# EAGLE design diyduino (EAGLE 8.4.1)
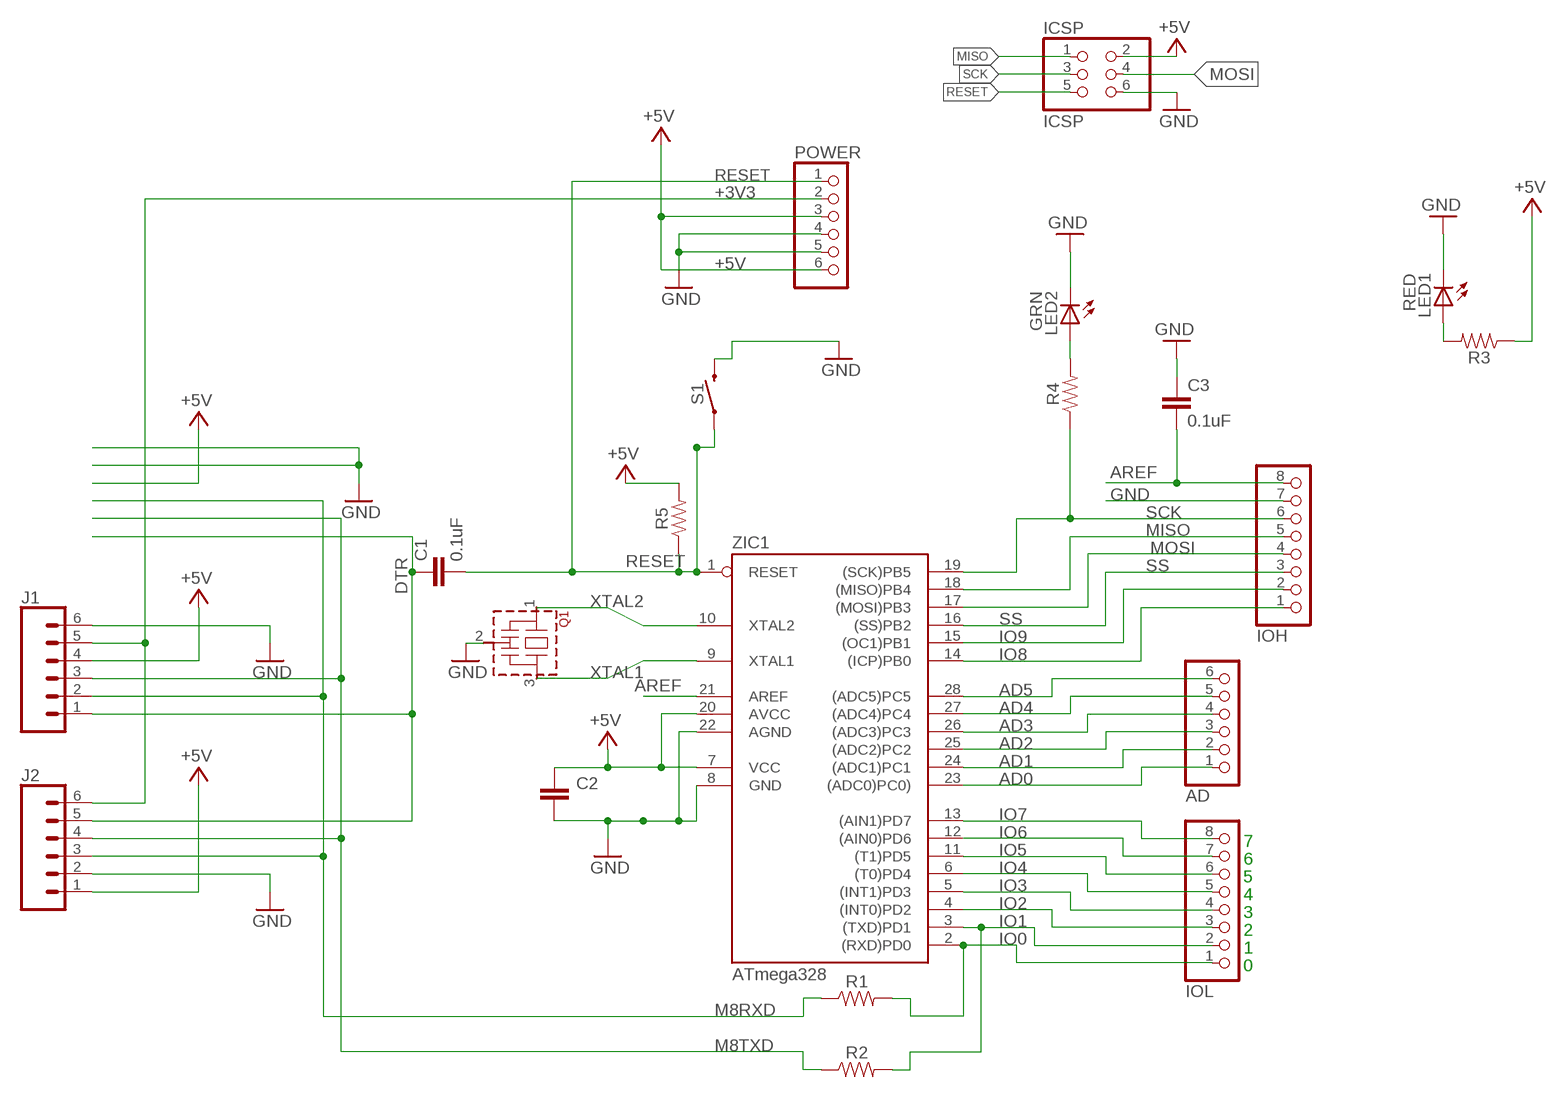
[diagram p0: schematic, sheet 1]

## Parts
AD  PINHD-1X6  [1X06]
C1  0.1uF  C2.5/2  [C2.5-2]
C2  0.1uF  C2.5/2  [C2.5-2]
C3  0.1uF  C2.5/2  [C2.5-2]
ICSP  ICSP  PINHD-2X3  [2X03]
IOH  PINHD-1X8  [1X08]
IOL  PINHD-1X8  [1X08]
J1  CONN_06SILK_FEMALE_PTH  [1X06]
J2  CONN_06SILK_FEMALE_PTH  [1X06]
LED1  RED  LED3MM  [LED3MM]
LED2  GRN  LED3MM  [LED3MM]
POWER  PINHD-1X6  [1X06]
Q1  CSTLS_X  [CSTLS_X]
R1  RESISTORAXIAL-0.3  [AXIAL-0.3]
R2  RESISTORAXIAL-0.3  [AXIAL-0.3]
R3  RESISTORAXIAL-0.3  [AXIAL-0.3]
R4  RESISTORAXIAL-0.3  [AXIAL-0.3]
R5  RESISTORAXIAL-0.3  [AXIAL-0.3]
S1  MOMENTARY-SWITCH-SPST-PTH-6.0MM  [TACTILE_SWITCH_PTH_6.0MM]
ZIC1  ATmega328  AT90S4433P  [DIL28-3]

## Nets
+3V3: J1.5 J2.6 POWER.2
+5V: C2.2 ICSP.2 J1.4 J2.1 POWER.3 POWER.6 R3.P$1 R5.P$2 ZIC1.7(VCC) ZIC1.20(AVCC)
AD0: AD.1 ZIC1.23((ADC0)PC0))
AD1: AD.2 ZIC1.24((ADC1)PC1)
AD2: AD.3 ZIC1.25((ADC2)PC2)
AD3: AD.4 ZIC1.26((ADC3)PC3)
AD4: AD.5 ZIC1.27((ADC4)PC4)
AD5: AD.6 ZIC1.28((ADC5)PC5)
AREF: C3.2 IOH.8 ZIC1.21(AREF)
DTR: C1.1 J1.1 J2.5
GND: C2.1 C3.1 ICSP.6 IOH.7 J1.6 J2.2 LED1.K(C) LED2.K(C) POWER.4 POWER.5 Q1.2(VSS) S1.3 ZIC1.8(GND) ZIC1.22(AGND)
IO0: IOL.1 R1.P$2 ZIC1.2((RXD)PD0)
IO1: IOL.2 R2.P$2 ZIC1.3((TXD)PD1)
IO2: IOL.3 ZIC1.4((INT0)PD2)
IO3: IOL.4 ZIC1.5((INT1)PD3)
IO4: IOL.5 ZIC1.6((T0)PD4)
IO5: IOL.6 ZIC1.11((T1)PD5)
IO6: IOL.7 ZIC1.12((AIN0)PD6)
IO7: IOL.8 ZIC1.13((AIN1)PD7)
IO8: IOH.1 ZIC1.14((ICP)PB0)
IO9: IOH.2 ZIC1.15((OC1)PB1)
M8RXD: J1.2 J2.3 R1.P$1
M8TXD: J1.3 J2.4 R2.P$1
MISO: ICSP.1 IOH.5 ZIC1.18((MISO)PB4)
MOSI: ICSP.4 IOH.4 ZIC1.17((MOSI)PB3)
N$1: LED2.A R4.P$2
N$2: LED1.A R3.P$2
RESET: C1.2 ICSP.5 POWER.1 R5.P$1 S1.1 ZIC1.1(RESET)
SCK: ICSP.3 IOH.6 R4.P$1 ZIC1.19((SCK)PB5)
SS: IOH.3 ZIC1.16((SS)PB2)
XTAL1: Q1.3 ZIC1.9(XTAL1)
XTAL2: Q1.1 ZIC1.10(XTAL2)

## Notes on the sheet
- 7
- 6
- 5
- 4
- 3
- 2
- 1
- 0

## Library data of the parts
AD POWER = pinhead:PINHD-1X6: PIN HEADER
C1-C3 = capacitor-wima:C: CAPACITOR naming: grid - package width
ICSP = pinhead:PINHD-2X3: PIN HEADER
IOH IOL = pinhead:PINHD-1X8: PIN HEADER
J1 J2 = SparkFun-Connectors:CONN_06: Multi connection point. Often used as Generic Header-pin footprint for 0.1 inch spaced/style header connections On any of the 0.1 inch spaced packages, you can populate with these: Break Away Headers - Straight <https://www.sparkfun.com/products/116> (PRT-00116) Break Away Male Headers - Right Angle <https://www.sparkfun.com/products/553> (PRT-00553) Female Headers <https://www.sparkfun.com/products/115> (PRT-00115) Break Away Headers - Machine Pin <https://www.sparkfun.com/products/117> (PRT-00117) Break Away Female Headers - Swiss Machine Pin <https://www.sparkfun.com/products/743> (PRT-00743) Arduino Stackable Header - 6 Pin <https://www.sparkfun.com/products/9280> (PRT-09280) For SCREWTERMINALS and SPRING TERMINALS visit here: Screw Terimnals on SparkFun.com <https://www.sparkfun.com/search/results?term=Screw+Terminals> (5mm/3.5mm/2.54mm spacing) This device is also useful as a general connection point to wire up your design to another part of your project. Our various solder wires solder well into these plated through hole pads. Hook-Up Wire - Assortment (Stranded, 22 AWG) <https://www.sparkfun.com/products/11375> (PRT-11375) Hook-Up Wire - Assortment (Solid Core, 22 AWG) <https://www.sparkfun.com/products/11367> (PRT-11367) View the entire wire category on our website here <https://www.sparkfun.com/categories/141>; PROD_ID: CONN-08437
LED1 LED2 = adafruit:LED: LED OSRAM: - CHIPLED LG R971, LG N971, LY N971, LG Q971, LY Q971, LO R971, LY R971 LH N974, LH R974 LS Q976, LO Q976, LY Q976 LO Q996 - Hyper CHIPLED LW Q18S LB Q993, LB Q99A, LB R99A - SideLED LS A670, LO A670, LY A670, LG A670, LP A670 LB A673, LV A673, LT A673, LW A673 LH A674 LY A675 LS A676, LA A676, LO A676, LY A676, LW A676 LS A679, LY A679, LG A679 - Hyper Micro SIDELED® LS Y876, LA Y876, LO Y876, LY Y876 LT Y87S - SmartLED LW L88C, LW L88S LB L89C, LB L89S, LG L890 LS L89K, LO L89K, LY L89K LS L896, LA L896, LO L896, LY L896 - TOPLED LS T670, LO T670, LY T670, LG T670, LP T670 LSG T670, LSP T670, LSY T670, LOP T670, LYG T670 LG T671, LOG T671, LSG T671 LB T673, LV T673, LT T673, LW T673 LH T674 LS T676, LA T676, LO T676, LY T676, LB T676, LH T676, LSB T676, LW T676 LB T67C, LV T67C, LT T67C, LS T67K, LO T67K, LY T67K, LW E67C LS E67B, LA E67B, LO E67B, LY E67B, LB E67C, LV E67C, LT E67C LW T67C LS T679, LY T679, LG T679 LS T770, LO T770, LY T770, LG T770, LP T770 LB T773, LV T773, LT T773, LW T773 LH T774 LS E675, LA E675, LY E675, LS T675 LS T776, LA T776, LO T776, LY T776, LB T776 LHGB T686 LT T68C, LB T68C - Hyper Mini TOPLED® LB M676 - Mini TOPLED Santana® LG M470 LS M47K, LO M47K, LY M47K Source: http://www.osram.convergy.de/
Q1 = murata-resonators:CSTLS_X: Ceramic resonator 16.00 to 70.00 MHz
R1-R5 = SparkFun-Resistors:RESISTOR: Generic Resistor Package
S1 = SparkFun-Switches:MOMENTARY-SWITCH-SPST: Momentary Switch (Pushbutton) - SPST Normally-open (NO) SPST momentary switches (buttons, pushbuttons). Variants PTH-12MM - 12mm square, through-hole Momentary Pushbutton Switch - 12mm Square <https://www.sparkfun.com/products/9190> (COM-09190) PTH-6.0MM, PTH-6.0MM-KIT - 6.0mm square, through-hole Mini Pushbutton Switch <https://www.sparkfun.com/products/97> (COM-00097) KIT package intended for soldering kit's - only one side of pads' copper is exposed. PTH-RIGHT-ANGLE-KIT - Right-angle, through-hole Right Angle Tactile Button <https://www.sparkfun.com/products/10791> - Used on SparkFun BigTime Watch Kit <https://www.sparkfun.com/products/11734> SMD-12MM - 12mm square, surface-mount Tactile Button - SMD (12mm) <https://www.sparkfun.com/products/12993> (COM-12993) Used on SparkFun PicoBoard <https://www.sparkfun.com/products/11888> SMD-4.5MM - 4.5mm Square Trackball Switch Used on SparkFun Blackberry Trackballer Breakout <https://www.sparkfun.com/products/13169> SMD-4.6MMX2.8MM - 4.60mm x 2.80mm, surface mount Used on SparkFun SAMD21 Mini Breakout <https://www.sparkfun.com/products/13664> SMD-5.2MM, SMD-5.2-REDUNDANT - 5.2mm square, surface-mount Mini Pushbutton Switch - SMD <https://www.sparkfun.com/products/8720> (COM-08720) Used on Arduino Pro Mini <https://www.sparkfun.com/products/11114> REDUNDANT package connects both switch circuits together SMD-6.0X3.5MM - 6.0 x 3.5mm, surface mount Momentary Reset Switch SMD <https://www.sparkfun.com/products/8229> (COM-08229) SMD-6.2MM-TALL - 6.2mm square, surface mount Tactile Button - SMD (6mm) <https://www.sparkfun.com/products/12992> Used on SparkFun Digital Sandbox <https://www.sparkfun.com/products/12651> SMD-RIGHT-ANGLE - Right-angle, surface mount Used on SparkFun Block for Intel® Edison - Arduino <https://www.sparkfun.com/products/13036>; PROD_ID: SWCH-08441; SF_SKU: COM-00097
ZIC1 = atmel:AT90S4433: MICROCONTROLLER 4 Kbytes FLASH 128 bytes SRAM 256 bytes EEPROM UART 6-channel 10 bit ADC; OC_FARNELL: unknown; OC_NEWARK: unknown

## Net classes
0 default: width 0.152 mm, drill 0.305 mm, clearance 0.152 mm

## Board
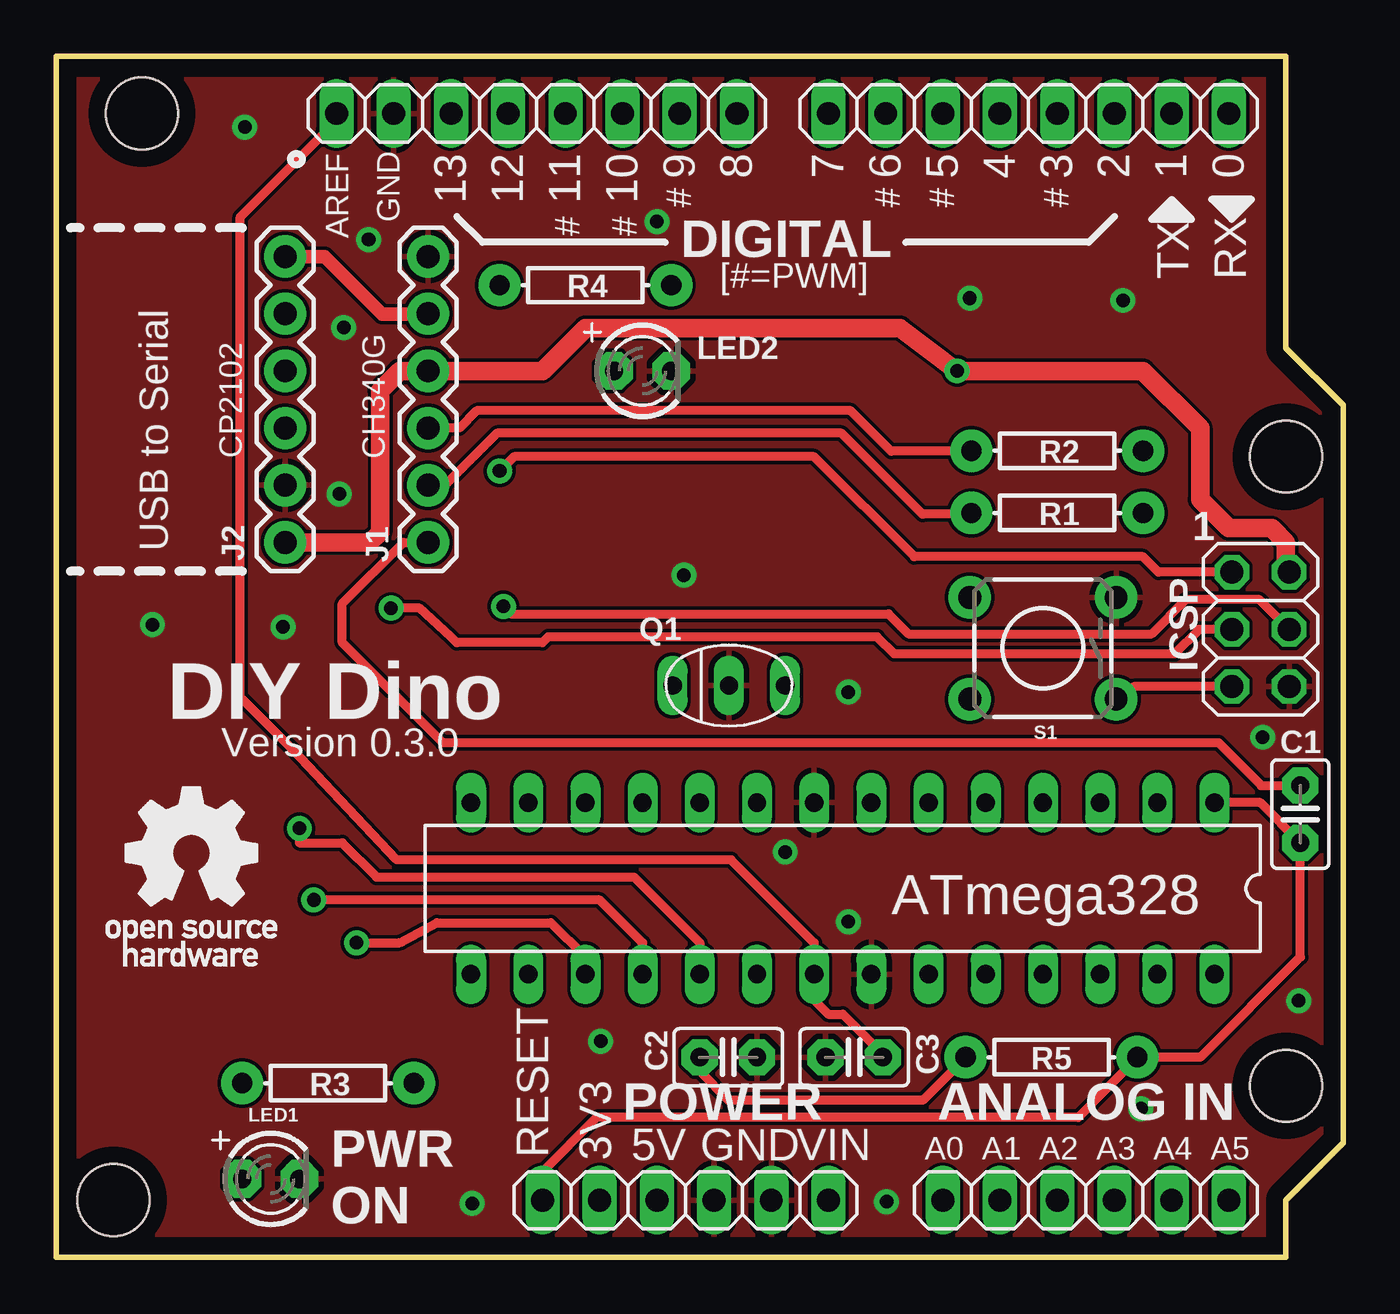
[diagram p1: board, top side]
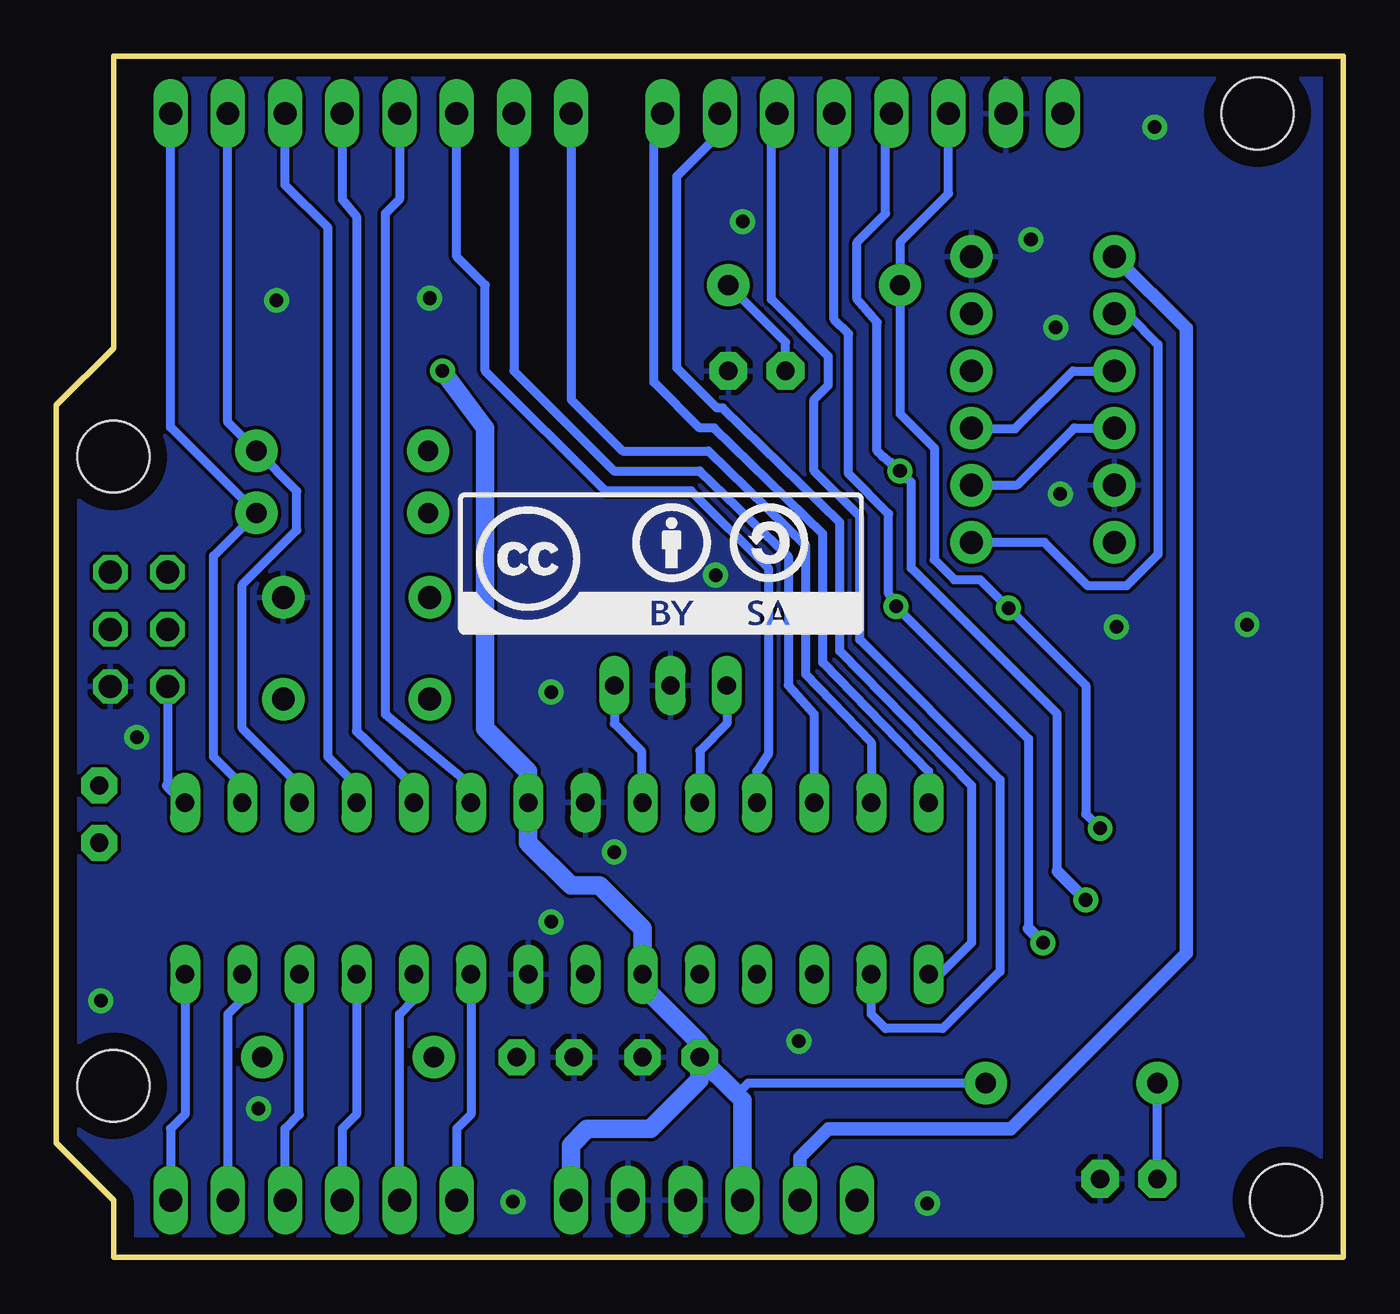
[diagram p2: board, bottom side, seen from below]

Size 57.15 x 53.34 mm. Coordinates in mm from the lower left corner, seen from the top.
Outline: 0,53.34 54.61,53.34 54.61,40.39 57.15,37.85 57.15,5.08 54.61,2.54 54.61,0 0,0 0,53.34
Copper layers (1*16): Top 0.035mm / dielectric 1.5mm / Bottom 0.035mm
Design rules "default *": minimum track width 8mil, minimum drill 12mil, track to track 6mil, track to pad 6mil, pad to pad 6mil, via to via 6mil, smd to smd 6mil, copper to edge 30mil, drill to drill 12mil, minimum pad ring 10mil, minimum via ring 10mil, stop-mask expansion 1mil, vias tented up to drill 0mil, thermal gap 10mil
Holes 3.2 mm at 54.61,35.56 54.61,7.62 3.81,50.8 2.54,2.54

### Footprints (pad centres in the part's own frame; a part is rotated, then mirrored left to right if it is on the bottom)
1X06 = drill 1.016 long: 1 -6.35,0; 2 -3.81,0; 3 -1.27,0; 4 1.27,0; 5 3.81,0; 6 6.35,0
C2.5-2 = drill 0.813 pad 1.6 octagon: 1 -1.27,0; 2 1.27,0
2X03 = drill 1.016 octagon: 1 -2.54,-1.27; 2 -2.54,1.27; 3 0,-1.27; 4 0,1.27; 5 2.54,-1.27; 6 2.54,1.27
1X08 = drill 1.016 long: 1 -8.89,0; 2 -6.35,0; 3 -3.81,0; 4 -1.27,0; 5 1.27,0; 6 3.81,0; 7 6.35,0; 8 8.89,0
1X06' = drill 1.016 pad 1.88: 1 0,0; 2 2.54,0; 3 5.08,0; 4 7.62,0; 5 10.16,0; 6 12.7,0
LED3MM = drill 0.813 pad 1.676 octagon: A -1.27,0; K 1.27,0
CSTLS_X = drill 0.813 long: 1 -2.5,0; 2 0,0; 3 2.5,0
AXIAL-0.3 = drill 0.9 pad 1.88: P$1 -3.81,0; P$2 3.81,0
TACTILE_SWITCH_PTH_6.0MM = drill 1.016 pad 1.88: 1 -3.251,2.261; 2 3.251,2.261; 3 -3.251,-2.261; 4 3.251,-2.261
DIL28-3 = drill 0.813 long: 1 -16.51,-3.81; 2 -13.97,-3.81; 3 -11.43,-3.81; 4 -8.89,-3.81; 5 -6.35,-3.81; 6 -3.81,-3.81; 7 -1.27,-3.81; 8 1.27,-3.81; 9 3.81,-3.81; 10 6.35,-3.81; 11 8.89,-3.81; 12 11.43,-3.81; 13 13.97,-3.81; 14 16.51,-3.81; 15 16.51,3.81; 16 13.97,3.81; 17 11.43,3.81; 18 8.89,3.81; 19 6.35,3.81; 20 3.81,3.81; 21 1.27,3.81; 22 -1.27,3.81; 23 -3.81,3.81; 24 -6.35,3.81; 25 -8.89,3.81; 26 -11.43,3.81; 27 -13.97,3.81; 28 -16.51,3.81

### Placement (x,y rotation side)
AD  45.72,2.54 0 top
C1  55.24,19.68 270 top
C2  29.84,8.89 180 top
C3  35.43,8.89 0 top
ICSP  53.48,27.89 270 top
IOH  21.34,50.8 180 top
IOL  43.18,50.8 180 top
J1  [1X06']  16.51,31.75 90 top
J2  [1X06']  10.16,31.75 90 top
LED1  9.52,3.48 0 top
LED2  26.04,39.37 0 top
POWER  27.94,2.54 0 top
Q1  29.87,25.4 0 top
R1  44.45,33.06 0 top
R2  44.45,35.82 0 top
R3  12.07,7.74 180 top
R4  23.49,43.18 0 top
R5  44.2,8.89 180 top
S1  43.81,27.05 180 top
ZIC1  34.92,16.38 180 top

### Tracks (layer width: path | path; a pad name or v marks a point on that pad's centre or on a via)
+3V3
  Top 0.406: 9.52,44.45 J2.6 | J1.5
  Top 0.61: J2.6 11.92,44.45 14.47,41.9 J1.5
  Bottom 0.61: POWER.2 24.13,4.45 22.86,5.71 14.75,5.71 6.97,13.5 6.97,41.26 J2.6
+5V  (via drill 0.6 pad 1)
  Top 0.406: R5.P$2 38.48,6.99 29.84,6.99 28.58,8.26 C2.2
  Top 0.813: ICSP.2 54.61,30.57 54.61,31.75 53.98,32.38 52.07,32.38 50.8,33.66 50.8,36.83 48.26,39.37 v40.01,39.37 37.47,41.27 23.49,41.27 21.59,39.37 J1.4 15.24,39.37 14.37,38.5 14.37,32.2 13.92,31.75 J2.1
  Bottom 0.406: R3.P$1 26.43,7.74 26.93,7.24
  Bottom 0.813: v40.01,39.37 38.1,36.83 38.1,23.5 36.2,21.59 ZIC1.7 36.2,18.41 34.29,16.51 33.02,16.51 31.12,14.61 ZIC1.20 31.12,12.06 28.58,9.53 C2.2 | C2.2 26.93,7.24 26.67,6.99 POWER.3 | C2.2 28.58,7.89 30.77,5.7 33.57,5.7 34.29,4.98 POWER.6
AD0
  Bottom 0.406: ZIC1.23 38.73,6.35 39.37,5.71 AD.1
AD1
  Bottom 0.406: AD.2 41.91,10.79 41.27,11.43 ZIC1.24
AD2
  Bottom 0.406: ZIC1.25 43.81,6.35 44.45,5.71 AD.3
AD3
  Bottom 0.406: AD.4 46.99,5.71 46.35,6.35 ZIC1.26
AD4
  Bottom 0.406: ZIC1.27 48.9,11.43 49.53,10.79 AD.5
AD5
  Bottom 0.406: ZIC1.28 51.44,6.35 52.07,5.71 AD.6
AREF
  Top 0.406: ZIC1.21 33.66,13.97 29.97,17.65 15.11,17.65 10.5,22.55 8.17,24.88 8.17,46.2 12.45,50.48 IOH.8 | 33.66,12.06 ZIC1.21 | ZIC1.21 33.66,11.43 34.29,10.79 34.92,10.79 36.7,9.02 C3.2
DTR
  Top 0.406: C1.1 53.51,20.95 51.6,22.86 17.14,22.86 12.7,27.3 12.7,29.03 15.42,31.75 J1.1
  Bottom 0.406: J2.5 9.52,41.84 8.23,40.54 8.23,31.21 9.62,29.82 11.33,29.82 13.26,31.75 J1.1
GND  (via drill 0.6 pad 1)
  Bottom 0.508: POWER.5 31.86,2.65
  other vias: 36.87,2.47 48.17,6.6 55.17,11.4 35.17,14.9 32.37,18 35.17,25.1 27.87,30.3 12.57,33.9 12.77,41.3 26.67,46 13.87,45.2 40.57,42.6 47.37,42.5 4.27,28.1 10.07,28 18.47,2.4 53.57,23.1 24.17,9.6 8.37,50.2
  pour Bottom (rank 2): 0.63,52.7 56.26,52.7 56.51,52.45 56.51,0.64 0.63,0.64
  pour Top (rank 2): 0.63,52.7 56.51,52.7 56.51,0.64 0.63,0.64
IO0
  Bottom 0.406: ZIC1.2 48.9,20.95 50.16,22.23 50.16,31.16 R1.P$2 52.07,36.87 IOL.1
IO1
  Bottom 0.406: ZIC1.3 46.35,20.95 48.9,23.5 48.9,29.88 46.47,32.3 46.47,34.03 R2.P$2 49.53,37.09 IOL.2
IO2
  Bottom 0.406: ZIC1.4 43.81,20.95 45.09,22.23 45.09,45.72 46.99,47.62 IOL.3
IO3
  Bottom 0.406: IOL.4 44.45,46.99 43.81,46.23 43.81,23.37 41.27,20.95 ZIC1.5
IO4
  Bottom 0.406: ZIC1.6 38.73,20.95 42.55,24.13 42.55,46.35 41.91,46.99 IOL.5
IO5
  Bottom 0.406: ZIC1.11 26.04,21.59 25.53,22.35 25.53,30.61 28.96,34.04 32.77,34.04 38.1,39.37 38.1,43.18 39.37,44.45 IOL.6
IO6
  Bottom 0.406: ZIC1.12 23.49,24.13 24.64,25.4 24.64,31.11 28.58,34.92 32.38,34.92 36.83,39.37 IOL.7
IO7
  Bottom 0.406: IOL.8 34.29,38.1 32,35.81 28.19,35.81 23.88,31.62 23.88,25.91 20.95,22.86 ZIC1.13
IO8
  Bottom 0.406: ZIC1.14 18.41,21.59 23.11,26.42 23.11,32.13 27.94,36.83 28.58,36.83 30.61,38.86 30.61,49.4 30.48,49.53 30.48,50.55 IOH.1
IO9
  Bottom 0.406: ZIC1.15 17.91,12.57 16.51,13.97 16.51,20.95 22.35,26.92 22.35,32.64 27.56,37.72 27.81,37.72 29.59,39.5 29.59,48.01 28.07,49.53 27.94,49.53 27.94,50.55 IOH.2
M8RXD
  Top 0.406: R1.P$1 40.58,33 38.47,33 34.87,36.6 19.57,36.6 17.26,34.29 J1.2
  Bottom 0.406: J1.2 14.47,34.3 11.94,36.83 J2.3
M8TXD
  Top 0.406: R2.P$1 40.62,35.8 37.07,35.8 35.27,37.6 18.67,37.6 17.9,36.83 J1.3
  Bottom 0.406: J1.3 16.48,36.8 14.57,36.8 12,39.37 J2.4
MISO  (via drill 0.6 pad 1)
  Top 0.406: ZIC1.18 26.04,13.97 24.13,15.88 v11.43,15.88 | ICSP.1 48.95,30.43 48.26,31.11 38.1,31.11 33.66,35.56 20.32,35.56 v19.68,34.92
  Bottom 0.406: 12.7,17.14 12.7,24.13 19.18,30.61 19.18,34.42 v19.68,34.92 | v19.68,34.92 20.07,35.31 | IOH.5 20.32,50.55 20.32,46.35 21.59,45.09 21.59,42.55 20.7,41.53 20.7,35.81 v19.68,34.92 | 20.45,35.56 v19.68,34.92
  Bottom 0.508: v11.43,15.88 12.7,17.14
MOSI  (via drill 0.6 pad 1)
  Top 0.406: v13.34,13.97 15.24,13.97 16.89,14.86 21.97,14.86 23.49,13.34 | 54.56,27.89 ICSP.4 53.43,29.21 50.16,29.21 48.64,27.69 37.85,27.69 36.96,28.57 20.19,28.57 v19.85,28.91
  Top 0.508: 23.49,13.34 ZIC1.17
  Bottom 0.406: IOH.4 22.61,41.66 21.97,41.02 21.97,34.8 20.19,33.02 20.19,29.46 19.85,29.12 v19.85,28.91 13.97,23.03 13.97,14.61
  Bottom 0.508: 13.97,14.61 v13.34,13.97
N$1
  Bottom 0.406: LED2.A 24.77,40.64 R4.P$2
N$2
  Bottom 0.406: LED1.A R3.P$2
RESET
  Top 0.406: ICSP.5 47.85,25.35 S1.1 | POWER.1 21.59,3.81 23.99,6.21 45.38,6.21 R5.P$1 50.8,8.89 55.24,13.34 C1.2 53.47,20.19 ZIC1.1
  Bottom 0.406: ICSP.5 52.21,20.97
  Bottom 0.508: 52.21,20.97 ZIC1.1
SCK  (via drill 0.6 pad 1)
  Top 0.406: v10.8,19.05 10.8,18.41 12.7,18.41 14.22,16.89 25.65,16.89 28.58,13.97 ZIC1.19 | ICSP.3 50.75,27.89 49.66,26.8 37.21,26.8 36.45,27.56 21.84,27.56 21.59,27.3 17.78,27.3 17.53,27.56 16.13,28.83 v14.86,28.83
  Bottom 0.406: v10.8,19.05 11.43,19.68 11.43,25.4 v14.86,28.83 16.13,30.1 17.27,30.1 18.16,30.99 18.16,35.94 19.68,37.47 R4.P$1 19.68,45.09 17.53,47.24 IOH.6
SS
  Bottom 0.406: ZIC1.16 20.95,10.79 20.32,10.16 17.78,10.16 15.24,12.7 15.24,21.21 21.46,27.43 21.46,32.89 23.49,34.92 23.49,38.1 22.86,38.73 22.86,40.01 25.4,42.55 25.4,50.16 25.15,50.42 IOH.3
XTAL1
  Bottom 0.406: Q1.3 32.37,23.7 31.17,22.5 31.17,20.25 ZIC1.9
XTAL2
  Bottom 0.406: Q1.1 27.37,23.7 28.57,22.5 ZIC1.10

### Text on the board
tPlace: 13 | 12 | 11 | 10 | 9 | 8 | 7 | 6 | 5 | 4 | 3 | 2 | 1 | 0
bPlace: /Users/chris/Downloads/cc-by-sa-bw.bmp
tNames: AREF | GND | # | # | # | # | # | # | DIGITAL | [#=PWM] | TX | RX | CP2102 | CH340G | 1 | USB to Serial | DIY Dino | Version 0.3.0 | C1 | C3 | C2 | ANALOG IN | RESET | 3V3 | 5V | GND | VIN | A0 | A1 | A2 | A3 | A4 | A5 | PWR / ON
214bmp: D:/SmartProjects/Snc/a4_bn_logo2.bmp